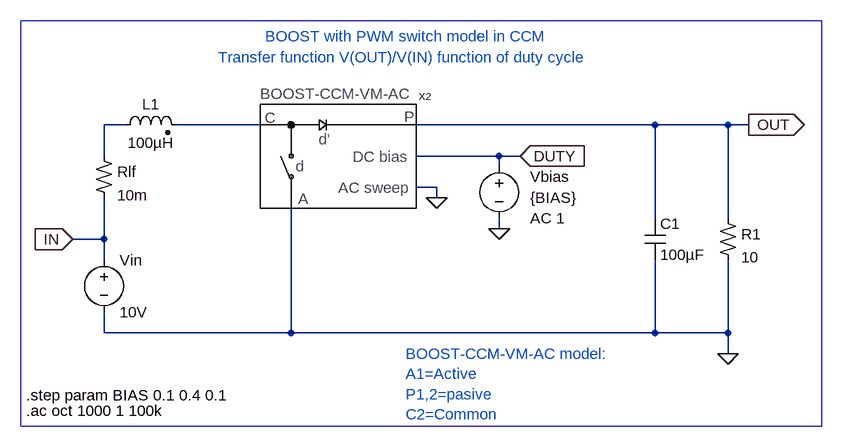
[diagram p0: schematic Switch-Mode_Power_Supplies_-_Basso-_Figure_2-26.asc]
Switch-Mode_Power_Supplies_-_Basso-_Figure_2-26.asc, the LTspice schematic file:
Version 4
SHEET 1 880 680
WIRE -976 -272 -1008 -272
WIRE -768 -272 -896 -272
WIRE -160 -272 -528 -272
WIRE -48 -272 -160 -272
WIRE -16 -272 -48 -272
WIRE -1008 -224 -1008 -272
WIRE -400 -224 -528 -224
WIRE -368 -224 -400 -224
WIRE -400 -208 -400 -224
WIRE -496 -176 -528 -176
WIRE -496 -160 -496 -176
WIRE -160 -128 -160 -272
WIRE -48 -128 -48 -272
WIRE -400 -112 -400 -128
WIRE -1008 -96 -1008 -160
WIRE -1008 -96 -1056 -96
WIRE -1008 -64 -1008 -96
WIRE -1008 48 -1008 16
WIRE -720 48 -720 -144
WIRE -720 48 -1008 48
WIRE -160 48 -160 -64
WIRE -160 48 -720 48
WIRE -48 48 -48 -64
WIRE -48 48 -160 48
WIRE -48 80 -48 48
FLAG -400 -112 0
FLAG -16 -272 OUT
IOPIN -16 -272 Out
FLAG -1056 -96 IN
IOPIN -1056 -96 In
FLAG -48 80 0
FLAG -368 -224 DUTY
IOPIN -368 -224 In
FLAG -496 -160 0
SYMBOL voltage -1008 -80 R0
WINDOW 123 0 0 Left 0
WINDOW 39 0 0 Left 0
SYMATTR InstName Vin
SYMATTR Value 10V
SYMBOL voltage -400 -224 R0
WINDOW 123 48 96 Left 0
WINDOW 39 0 0 Left 0
WINDOW 0 48 32 Left 0
WINDOW 3 48 64 Left 0
SYMATTR Value2 AC 1
SYMATTR InstName Vbias
SYMATTR Value {BIAS}
SYMBOL ind2 -992 -256 R270
WINDOW 0 32 56 VTop 0
WINDOW 3 4 56 VBottom 0
SYMATTR InstName L1
SYMATTR Value 100µH
SYMBOL cap -176 -128 R0
SYMATTR InstName C1
SYMATTR Value 100µF
SYMBOL res2 -64 -128 R0
SYMATTR InstName R1
SYMATTR Value 10
SYMBOL res2 -1024 -224 R0
SYMATTR InstName Rlf
SYMATTR Value 10m
SYMBOL BOOST-CCM-VM-AC -592 -240 R0
SYMATTR InstName X2
TEXT -1128 168 Left 0 !.ac oct 1000 1 100k
TEXT -544 80 Left 0 ;BOOST-CCM-VM-AC model:\nA1=Active\nP1,2=pasive\nC2=Common
TEXT -1128 144 Left 0 !.step param BIAS 0.1 0.4 0.1
TEXT -760 -408 Left 0 ;BOOST with PWM switch model in CCM
TEXT -832 -376 Left 0 ;Transfer function V(OUT)/V(IN) function of duty cycle
RECTANGLE Normal 96 192 -1136 -432

The netlist it stands for:
* Switch-Mode_Power_Supplies_-_Basso-_Figure_2-26.asc
Vin IN 0 10V
Vbias DUTY 0 {BIAS} AC 1
L1 N001 N002 100µH
C1 OUT 0 100µF
R1 OUT 0 10
Rlf N001 IN 10m
XX2 0 OUT DUTY N002 0 BOOST-CCM-VM-AC  ; pins A P D C AC
.ac oct 1000 1 100k
* BOOST-CCM-VM-AC model:
* A1=Active
* P1,2=pasive
* C2=Common
.step param BIAS 0.1 0.4 0.1
* BOOST with PWM switch model in CCM
* Transfer function V(OUT)/V(IN) function of duty cycle
.backanno
.end